# EAGLE schematic spot_check_rev_3 (EAGLE 9.6.2)
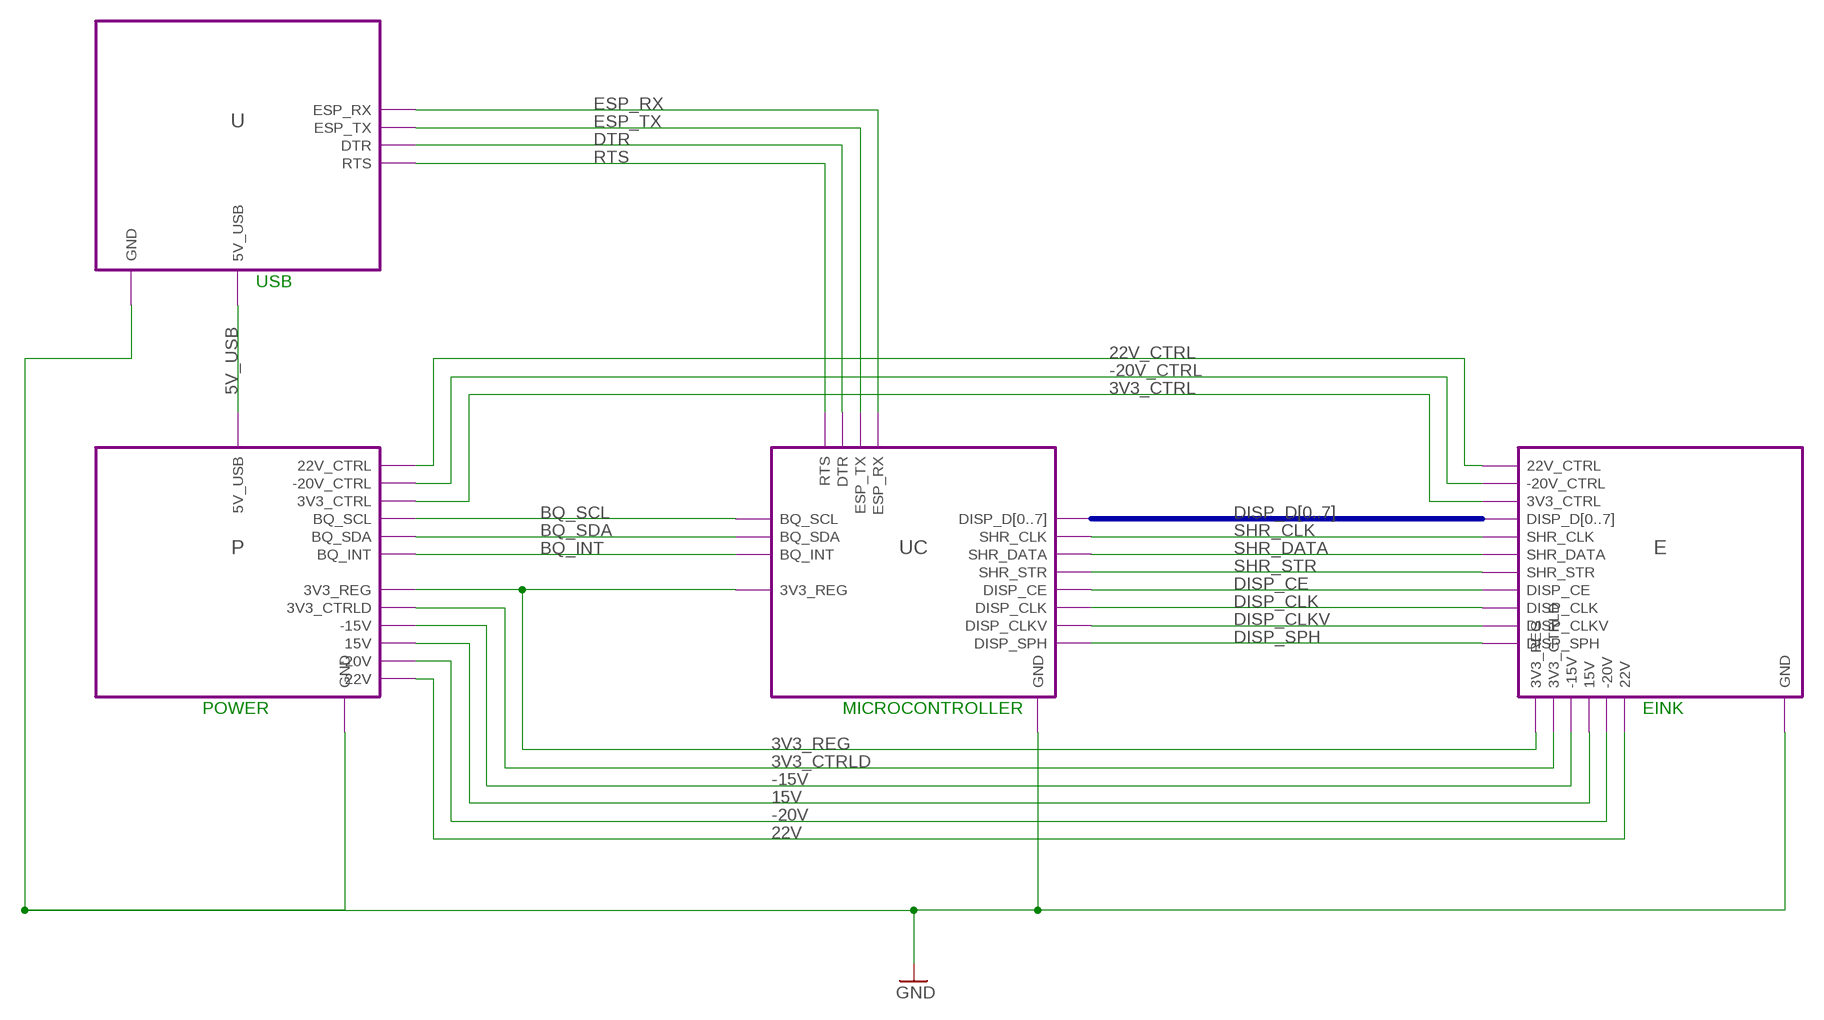
[diagram p0: schematic, sheet 1]

## Module instances
P = POWER
UC = MICROCONTROLLER
E = E-INK-DISPLAY
U = USB

## Nets
3V3_CTRL: port P.3V3_CTRL E.3V3_CTRL
3V3_CTRLD: port E.3V3_CTRLD P.3V3_CTRLD
3V3_REG: port UC.3V3_REG P.3V3_REG E.3V3_REG
5V_USB: port U.5V_USB P.5V_USB
15V: port E.15V P.15V
22V: port E.22V P.22V
22V_CTRL: port E.22V_CTRL P.22V_CTRL
-15V: port E.-15V P.-15V
-20V: port E.-20V P.-20V
-20V_CTRL: port P.-20V_CTRL E.-20V_CTRL
BQ_INT: port P.BQ_INT UC.BQ_INT
BQ_SCL: port UC.BQ_SCL P.BQ_SCL
BQ_SDA: port P.BQ_SDA UC.BQ_SDA
DISP_CE: port UC.DISP_CE E.DISP_CE
DISP_CLK: port E.DISP_CLK UC.DISP_CLK
DISP_CLKV: port UC.DISP_CLKV E.DISP_CLKV
DISP_SPH: port E.DISP_SPH UC.DISP_SPH
DTR: port UC.DTR U.DTR
ESP_RX: port U.ESP_RX UC.ESP_RX
ESP_TX: port U.ESP_TX UC.ESP_TX
GND: port P.GND E.GND UC.GND U.GND
RTS: port U.RTS UC.RTS
SHR_CLK: port UC.SHR_CLK E.SHR_CLK
SHR_DATA: port UC.SHR_DATA E.SHR_DATA
SHR_STR: port E.SHR_STR UC.SHR_STR

## Buses
DISP_D[0..7]

## Notes on the sheet
- USB
- POWER | MICROCONTROLLER | EINK

## Library data of the parts

## Module POWER
Ports: 22V(pwr) -20V(pwr) 15V(pwr) -15V(pwr) 3V3_CTRLD(pwr) 3V3_REG(pwr) 5V_USB(pwr) GND(pwr) BQ_SCL(in) BQ_SDA(in) BQ_INT(out) 22V_CTRL(in) -20V_CTRL(in) 3V3_CTRL(in)
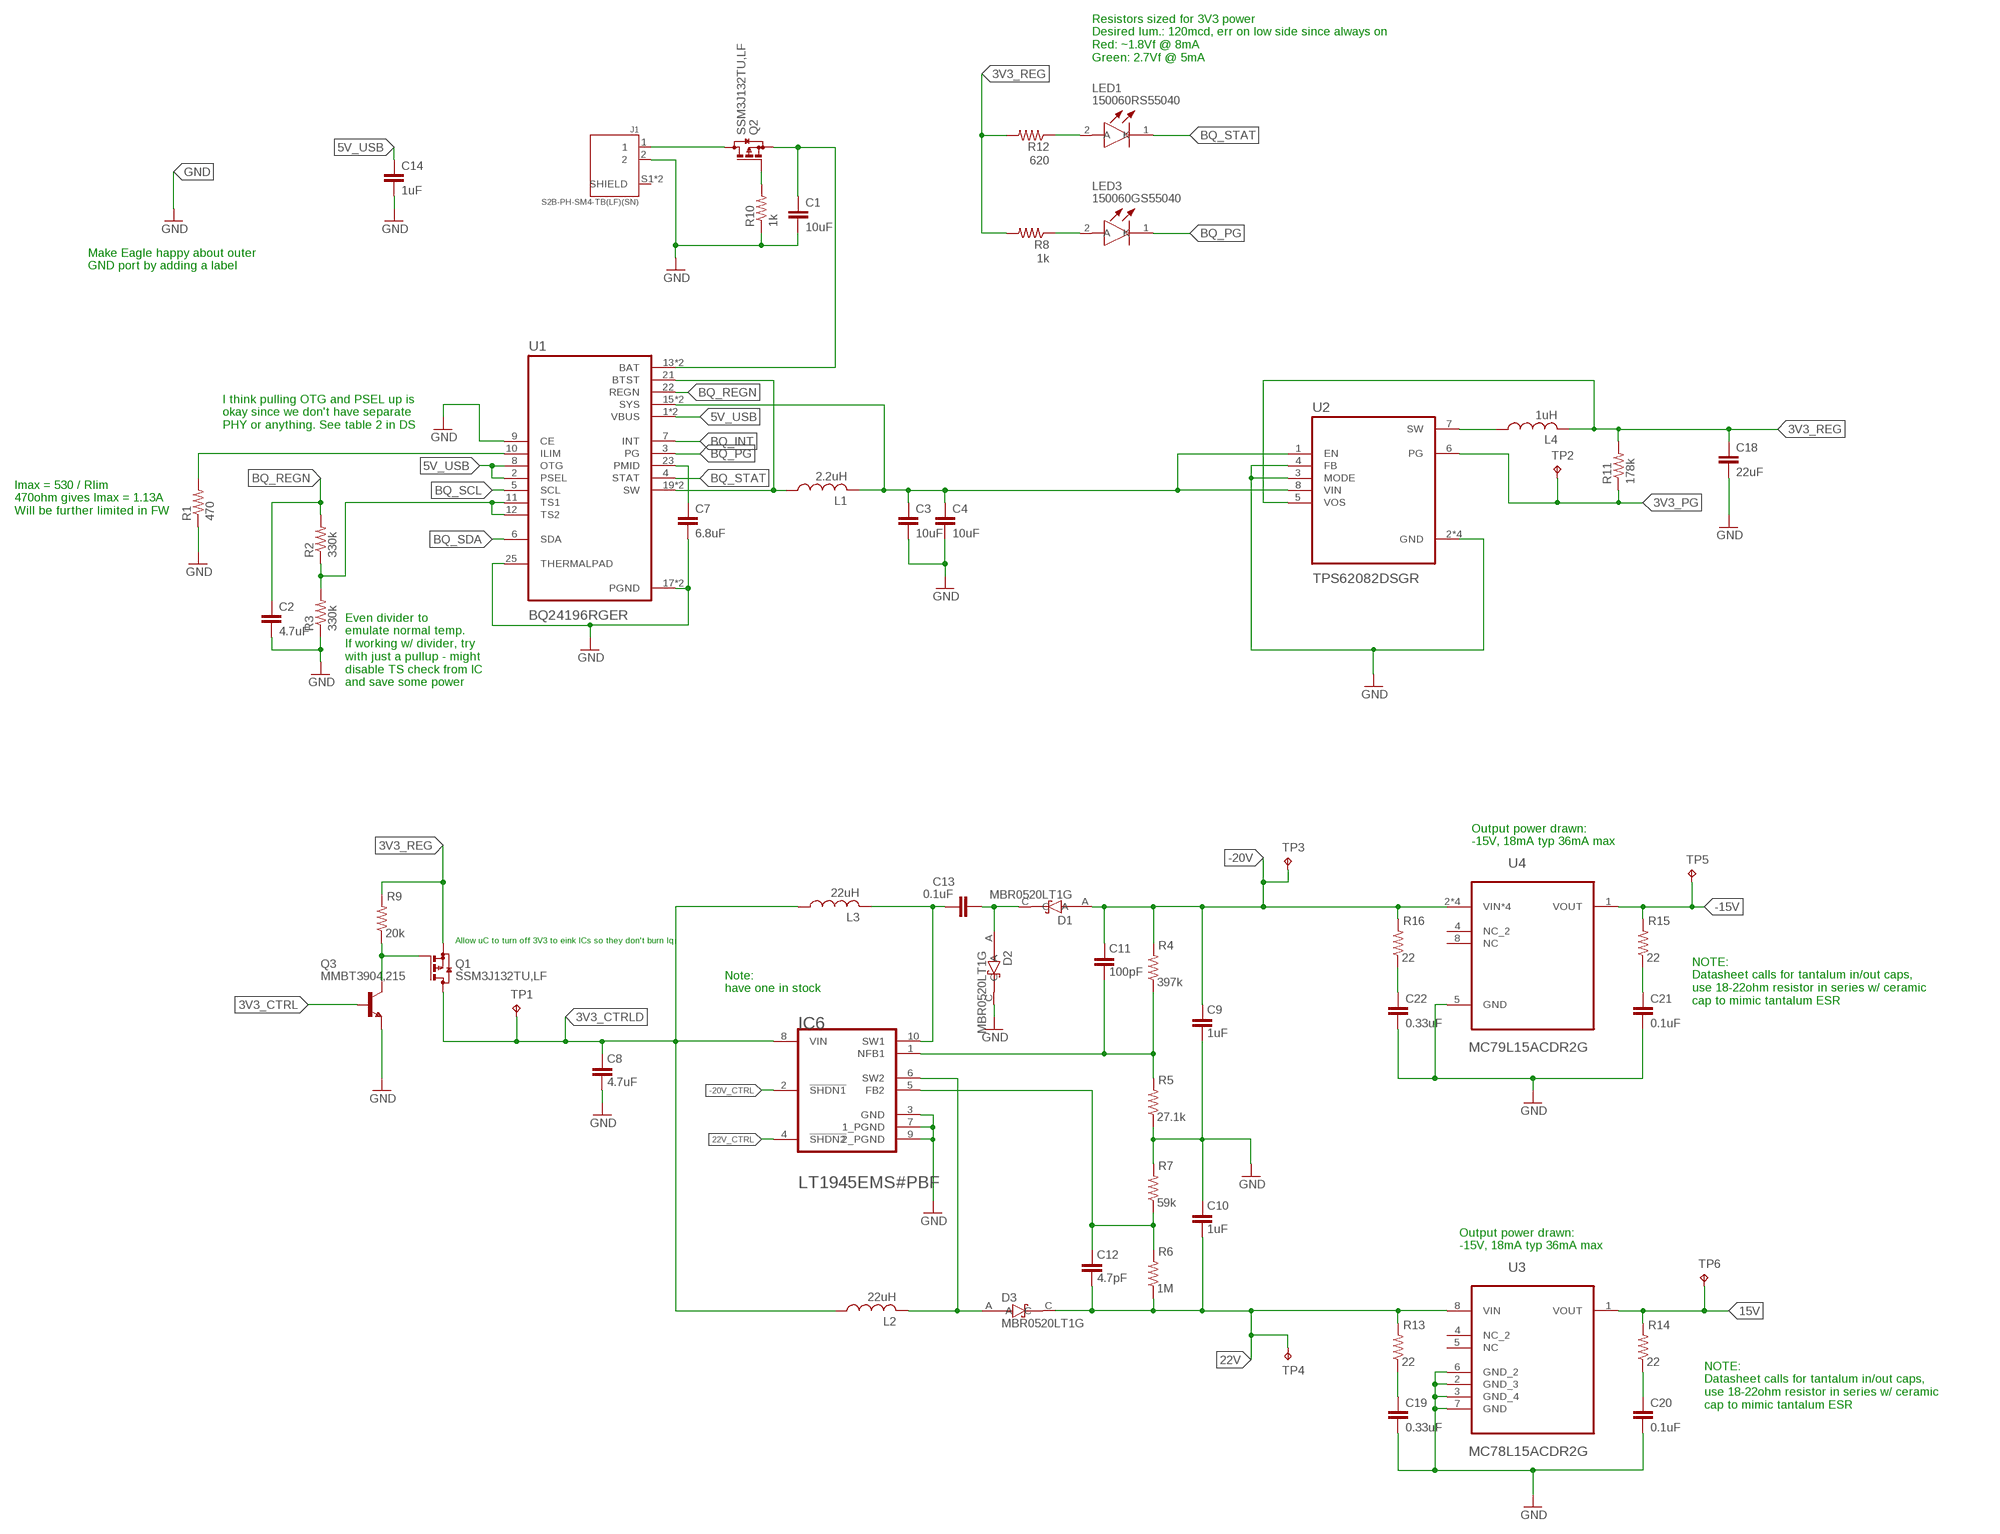
[diagram p1: schematic, module POWER, sheet 1]

### Parts
C1  10uF  C-EUC0805  [C0805]
C2  4.7uF  C-EUC0805  [C0805]
C3  10uF  C-EUC0805  [C0805]
C4  10uF  C-EUC0805  [C0805]
C7  6.8uF  C-EUC1210  [C1210]
C8  4.7uF  C-EUC0805  [C0805]
C9  1uF  C-EUC0805  [C0805]
C10  1uF  C-EUC0805  [C0805]
C11  100pF  C-EUC0805  [C0805]
C12  4.7pF  C-EUC0805  [C0805]
C13  0.1uF  C-EUC0805  [C0805]
C14  1uF  C-EUC0805  [C0805]
C18  22uF  C-EUC0805  [C0805]
C19  0.33uF  C-EUC0805  [C0805]
C20  0.1uF  C-EUC0805  [C0805]
C21  0.1uF  C-EUC0805  [C0805]
C22  0.33uF  C-EUC0805  [C0805]
D1  MBR0520LT1G  [SOD3716X135N]
D2  MBR0520LT1G  [SOD3716X135N]
D3  MBR0520LT1G  [SOD3716X135N]
IC6  LINEAR_TECHNOLOGY_LT1945EMS#PBFLINEAR_TECHNOLOGY_LT1945EMS#PBF_0_0  [LINEAR_TECHNOLOGY_LT1945EMS#PBF_0]
J1  S2B-PH-SM4-TB(LF)(SN)  [JST_S2B-PH-SM4-TB(LF)(SN)]
L1  2.2uH  L-USL1812  [L1812]
L2  22uH  L-US  [C1210]
L3  22uH  L-US  [C1210]
L4  1uH  L-USL1812  [L1812]
LED1  150060RS55040  150060VS75000  [LEDC1608X80N]
LED3  150060GS55040  150060VS75000  [LEDC1608X80N]
Q1  SSM3J132TU,LF  [SOT323]
Q2  SSM3J132TU,LF  [SOT323]
Q3  MMBT3904,215  BC848ALT1SMD  [SOT23]
R1  470  R-US_R0805  [R0805]
R2  330k  R-US_R0805  [R0805]
R3  330k  R-US_R0805  [R0805]
R4  397k  R-US_R0805  [R0805]
R5  27.1k  R-US_R0603  [R0603]
R6  1M  R-US_R0805  [R0805]
R7  59k  R-US_R0805  [R0805]
R8  1k  R-US_R0805  [R0805]
R9  20k  R-US_R0805  [R0805]
R10  1k  R-US_R0805  [R0805]
R11  178k  R-US_R0805  [R0805]
R12  620  R-US_R0805  [R0805]
R13  22  R-US_R0805  [R0805]
R14  22  R-US_R0805  [R0805]
R15  22  R-US_R0805  [R0805]
R16  22  R-US_R0805  [R0805]
TP1  TPB1,27  [B1,27]
TP2  TPB1,27  [B1,27]
TP3  TPB1,27  [B1,27]
TP4  TPB1,27  [B1,27]
TP5  TPB1,27  [B1,27]
TP6  TPB1,27  [B1,27]
U1  BQ24196RGER  [QFN50P400X400X100-25N]
U2  TPS62082DSGR  [SON50P200X200X80-9N]
U3  MC78L15ACDR2G  [SOIC127P600X175-8N]
U4  MC79L15ACDR2G  [SOIC127P600X175-8N]

### Nets
3V3_CTRL: Q3.1(B)
3V3_CTRLD: C8.1 IC6.8(VIN) L2.1 L3.1 Q1.3(D) TP1.TP
3V3_PG: R11.1 TP2.TP U2.6(PG)
3V3_REG: C18.1 L4.2 Q1.2(S) R8.2 R9.2 R11.2 R12.2 U2.5(VOS)
5V_USB: C14.1 U1.1(VBUS) U1.2(PSEL) U1.8(OTG) U1.24(VBUS)
15V: R14.2 TP6.TP U3.1(VOUT)
22V: C10.2 C12.2 D3.C R6.1 R13.2 TP4.TP U3.8(VIN)
22V_CTRL: IC6.4(!SHDN2!)
-15V: R15.2 TP5.TP U4.1(VOUT)
-20V: C9.1 C11.1 D1.A R4.2 R16.2 TP3.TP U4.2(VIN*4) U4.3(VIN*4) U4.6(VIN*4) U4.7(VIN*4)
-20V_CTRL: IC6.2(!SHDN1!)
BQ_INT: U1.7(INT)
BQ_PG: LED3.1(K) U1.3(PG)
BQ_REGN: C2.1 R2.2 U1.22(REGN)
BQ_SCL: U1.5(SCL)
BQ_SDA: U1.6(SDA)
BQ_STAT: LED1.1(K) U1.4(STAT)
GND: C1.2 C2.2 C3.2 C4.2 C7.2 C8.2 C9.2 C10.1 C14.2 C18.2 C19.2 C20.2 C21.2 C22.2 D2.C IC6.3(GND) IC6.7(1_PGND) IC6.9(2_PGND) J1.2 Q3.2(E) R1.1 R3.1 R5.1 R7.2 R10.1 U1.9(CE) U1.17(PGND) U1.18(PGND) U1.25(THERMALPAD) U2.2(GND) U2.3(MODE) U2.4(FB) U2.9(GND) U2.9_1(GND) U2.9_2(GND) U3.2(GND_3) U3.3(GND_4) U3.6(GND_2) U3.7(GND) U4.5(GND)
N$1: C1.1 Q2.2(S) U1.13(BAT) U1.14(BAT)
N$2: R2.1 R3.2 U1.11(TS1) U1.12(TS2)
N$3: L1.1 U1.19(SW) U1.20(SW) U1.21(BTST)
N$4: J1.1 Q2.3(D)
N$5: C7.1 U1.23(PMID)
N$6: R1.2 U1.10(ILIM)
N$7: LED3.2(A) R8.1
N$8: C3.1 C4.1 L1.2 U1.15(SYS) U1.16(SYS) U2.1(EN) U2.8(VIN)
N$9: Q2.1(G) R10.2
N$10: C12.1 IC6.5(FB2) R6.2 R7.1
N$11: L4.1 U2.7(SW)
N$12: LED1.2(A) R12.1
N$13: D3.A IC6.6(SW2) L2.2
N$14: C13.2 D1.C D2.A
N$15: Q1.1(G) Q3.3(C) R9.1
N$16: C13.1 IC6.10(SW1) L3.2
N$17: C11.2 IC6.1(NFB1) R4.1 R5.2
N$19: C22.1 R16.1
N$20: C21.1 R15.1
N$21: C20.1 R14.1
N$22: C19.1 R13.1
Unconnected: J1.S1(SHIELD) J1.S2(SHIELD) U3.4(NC_2) U3.5(NC) U4.4(NC_2) U4.8(NC)

### Notes on the sheet
- Resistors sized for 3V3 power
  Desired lum.: 120mcd, err on low side since always on
  Red: ~1.8Vf @ 8mA
  Green: 2.7Vf @ 5mA
- Make Eagle happy about outer
  GND port by adding a label
- I think pulling OTG and PSEL up is
  okay since we don't have separate 
  PHY or anything. See table 2 in DS
- Imax = 530 / Rlim
  470ohm gives Imax = 1.13A
  Will be further limited in FW
- Even divider to 
  emulate normal temp.
  If working w/ divider, try
  with just a pullup - might
  disable TS check from IC
  and save some power
- Output power drawn:
  -15V, 18mA typ 36mA max
- Allow uC to turn off 3V3 to eink ICs so they don't burn Iq
- Note:
  have one in stock
- NOTE:
  Datasheet calls for tantalum in/out caps,
  use 18-22ohm resistor in series w/ ceramic
  cap to mimic tantalum ESR
- Output power drawn:
  -15V, 18mA typ 36mA max
- NOTE:
  Datasheet calls for tantalum in/out caps,
  use 18-22ohm resistor in series w/ ceramic
  cap to mimic tantalum ESR

### Library data of the parts
C1-C4 C7-C14 C18-C22 = rcl:C-EU: CAPACITOR, European symbol; SPICEPREFIX: C
D1-D3 = MBR0520LT1G:MBR0520LT1G: Rectifier, Schottky Power; Plastic Sod-123; 0.5 a @ +90c If; +125; 20v; 1000 Check prices <https://pricing.snapeda.com/parts/MBR0520LT1G/ON%20Semiconductor/view-part?ref=eda>; AVAILABILITY: In Stock; DESCRIPTION: Diode Schottky 20V 500mA Surface Mount SOD-123; MF: ON Semiconductor; MP: MBR0520LT1G; PACKAGE: SOD-123-2 ON Semiconductor; PRICE: None; PURCHASE-URL: https://pricing.snapeda.com/search/part/MBR0520LT1G/?ref=eda
IC6 = LT1945EMS#PBF:LINEAR_TECHNOLOGY_LT1945EMS#PBF: LT-LT1945-MS-10; CIIVA_IDS: 1482624; COMPONENT_LINK_1_DESCRIPTION: Manufacturer URL; COMPONENT_LINK_1_URL: http://www.linear.com/; COMPONENT_LINK_3_DESCRIPTION: Package Specification; COMPONENT_LINK_3_URL: http://cds.linear.com/docs/en/packaging/05081661_F_MS.pdf; DATASHEET: http://cds.linear.com/docs/en/datasheet/1945fa.pdf; DATASHEET_VERSION: Rev. A; FOOTPRINT_VARIANT_NAME_0: Level C; FOOTPRINT_VARIANT_NAME_1: Level B; FOOTPRINT_VARIANT_NAME_2: Level A; IMPORTED: yes; IMPORTED_FROM: vault; IMPORT_TS: 1521842479; MF: Linear Technology; MOUNTING_TECHNOLOGY: Surface Mount; MPN: LT1945EMS#PBF; NUMBER_OF_OUTPUTS: 2; PACKAGE: MS-10; PACKAGE_DESCRIPTION: 10-Pin Plastic MSOP, Body 3 x 3 mm, Pitch 0.5 mm; PACKAGE_VERSION: Rev. E, 06/2010; PREFIX: U; RELEASE_DATE: 1377814922; ROHS: Yes; VAULT_GUID: B0F6C986-74D1-4265-A3D3-2E2E10FD489A; VAULT_REVISION: 624277BD-F6E2-44C2-9180-A8188AE27574; VIN_MAXV: 15; VIN_MINV: 1.2
J1 = JST-S2B-PH-SM4-TB_LF__SN_:S2B-PH-SM4-TB(LF)(SN): PH Series 2 Position 2 mm Pitch Surface Mount Side Entry Shrouded Header Check availability <https://pricing.snapeda.com/parts/S2B-PH-SM4-TB%28LF%29%28SN%29/JST%20Sales/view-part?ref=eda>; AVAILABILITY: In Stock; DESCRIPTION: Connector Header Surface Mount, Right Angle 2 position 0.079 (2.00mm); MF: JST Sales; MP: S2B-PH-SM4-TB(LF)(SN); PACKAGE: None; PRICE: None
L1 L4 = rcl:L-US: INDUCTOR, American symbol; SPICEPREFIX: L
L2 L3 = custom_rcl:L-US: INDUCTOR, American symbol
LED1 LED3 = 150060VS75000:150060VS75000: LED,Wurth Elektronik,150060VS75000 Wurth Elektronik 150060VS75000, WL-SMCW Series Green LED, 570 nm, 1608 (0603) Clear, Rectangle Lens SMD Package Source: Datasheet <http://docs-emea.rs-online.com/webdocs/1302/0900766b81302e1e.pdf> Check prices <https://pricing.snapeda.com/parts/150060VS75000/Wurth%20Elektronik/view-part?ref=eda>; AVAILABILITY: In Stock; DESCRIPTION: Green 570nm LED Indication - Discrete 2V 0603 (1608 Metric); MF: Wurth Elektronik; MP: 150060VS75000; PACKAGE: None; PRICE: None
Q1 Q2 = SSM3J132TU:SSM3J132TU,LF
Q3 = transistor-npn:BC848*: NPN Transistor
R1-R16 = rcl:R-US_: RESISTOR, American symbol; SPICEPREFIX: R
TP1-TP6 = testpad:TP: Test pad
U1 = BQ24196RGER:BQ24196RGER: Check prices <https://pricing.snapeda.com/parts/BQ24196RGER/Texas%20Instruments/view-part?ref=eda>; AVAILABILITY: In Stock; DESCRIPTION: I2C controlled 2.5A single cell USB/Adaptor charger w/ Narrow VDC Power Path 24-VQFN -40 to 85; MF: Texas Instruments; MP: BQ24196RGER; PACKAGE: VQFN-24 Texas Instruments; PRICE: None; PURCHASE-URL: https://pricing.snapeda.com/search/part/BQ24196RGER/?ref=eda
U2 = TPS62082DSGR:TPS62082DSGR: Check availability <https://pricing.snapeda.com/parts/TPS62082DSGR/Texas%20Instruments/view-part?ref=eda>; AVAILABILITY: In Stock; DESCRIPTION: 1.2A High Efficient Step Down Converter in 2x2mm SON Package. 3.3 Vout (Min) 8-WSON -40 to 125; MF: Texas Instruments; MP: TPS62082DSGR; PACKAGE: WSON-8 Texas Instruments; PRICE: None; PURCHASE-URL: https://pricing.snapeda.com/search/part/TPS62082DSGR/?ref=eda
U3 = MC78L15ACDR2G:MC78L15ACDR2G: Positive Linear Voltage Regulator Check availability <https://pricing.snapeda.com/parts/MC78L15ACDR2G/ON%20Semiconductor/view-part?ref=eda>; AVAILABILITY: In Stock; DESCRIPTION: Linear Voltage Regulator IC Positive Fixed 1 Output 100mA 8-SOIC; MF: ON Semiconductor; MP: MC78L15ACDR2G; PACKAGE: SOIC-8 ON Semiconductor; PRICE: None; PURCHASE-URL: https://pricing.snapeda.com/search/part/MC78L15ACDR2G/?ref=eda
U4 = MC78L15ACDR2G:MC79L15ACDR2G

## Module MICROCONTROLLER
Ports: DISP_D[0..7](out) 3V3_REG(pwr) SHR_CLK(out) SHR_DATA(out) SHR_STR(out) DISP_CE(out) DISP_CLK(out) DISP_CLKV(out) DISP_SPH(out) RTS(in) DTR(in) ESP_TX(out) ESP_RX(in) GND(pwr) BQ_SCL(out) BQ_SDA(out) BQ_INT(in)
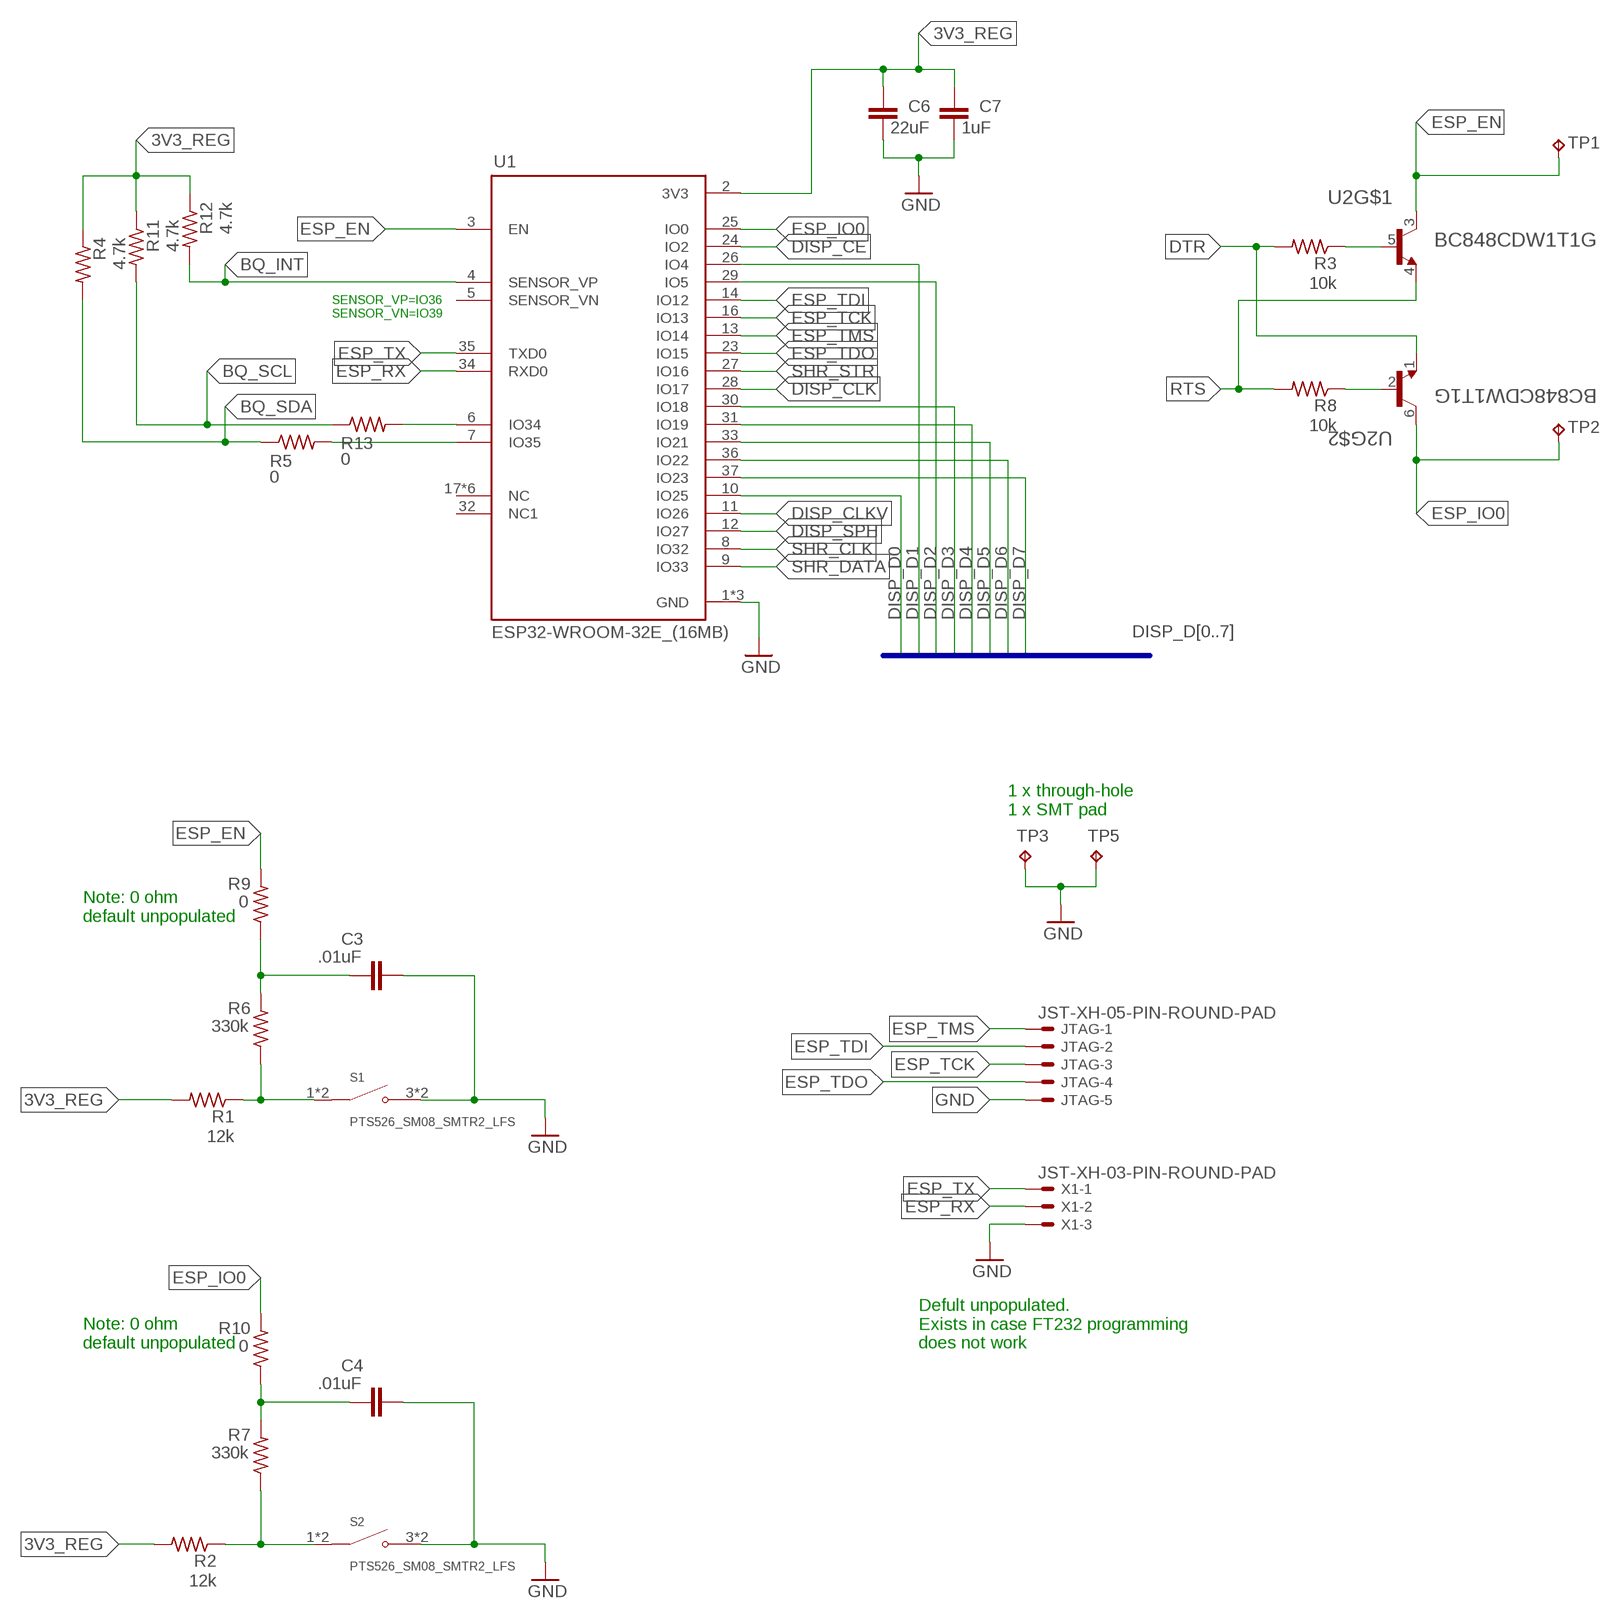
[diagram p2: schematic, module MICROCONTROLLER, sheet 1]

### Parts
C3  .01uF  C-EUC0805  [C0805]
C4  .01uF  C-EUC0805  [C0805]
C6  22uF  C-EUC0805  [C0805]
C7  1uF  C-EUC0805  [C0805]
JTAG  JST-XH-05-PIN-ROUND-PAD  [JST-XH-05-PACKAGE-ROUND-PAD]
R1  12k  R-US_R0805  [R0805]
R2  12k  R-US_R0805  [R0805]
R3  10k  R-US_R0805  [R0805]
R4  4.7k  R-US_R0805  [R0805]
R5  0  R-US_R0805  [R0805]
R6  330k  R-US_R0805  [R0805]
R7  330k  R-US_R0805  [R0805]
R8  10k  R-US_R0805  [R0805]
R9  0  R-US_R0805  [R0805]
R10  0  R-US_R0805  [R0805]
R11  4.7k  R-US_R0805  [R0805]
R12  4.7k  R-US_R0805  [R0805]
R13  0  R-US_R0805  [R0805]
S1  PTS526_SM08_SMTR2_LFS  [SW_PTS526_SM08_SMTR2_LFS]
S2  PTS526_SM08_SMTR2_LFS  [SW_PTS526_SM08_SMTR2_LFS]
TP1  TPB1,27  [B1,27]
TP2  TPB1,27  [B1,27]
TP3  TPPAD1-20  [P1-20]
TP5  TPB1,27  [B1,27]
U1  ESP32-WROOM-32E_(16MB)  [MODULE_ESP32-WROOM-32E_(16MB)]
U2  BC848CDW1T1G  [SOT65P210X110-6N]
X1  JST-XH-03-PIN-ROUND-PAD  [JST-XH-03-PACKAGE-ROUND-PAD]

### Nets
3V3_REG: C6.1 C7.1 R1.2 R2.2 R4.1 R11.1 R12.1 U1.2(3V3)
BQ_INT: R12.2 U1.4(SENSOR_VP)
BQ_SCL: R11.2 R13.1
BQ_SDA: R4.2 R5.1
DISP_CE: U1.24(IO2)
DISP_CLK: U1.28(IO17)
DISP_CLKV: U1.11(IO26)
DISP_D0: U1.10(IO25)
DISP_D1: U1.26(IO4)
DISP_D2: U1.29(IO5)
DISP_D3: U1.30(IO18)
DISP_D4: U1.31(IO19)
DISP_D5: U1.33(IO21)
DISP_D6: U1.36(IO22)
DISP_D7: U1.37(IO23)
DISP_SPH: U1.12(IO27)
DTR: R3.2 U2.1(EMITTER_2)
ESP_EN: R9.2 TP1.TP U1.3(EN) U2.3(COLLECTOR_1)
ESP_IO0: R10.2 TP2.TP U1.25(IO0) U2.6(COLLECTOR_2)
ESP_RX: U1.34(RXD0) X1.2
ESP_TCK: JTAG.3 U1.16(IO13)
ESP_TDI: JTAG.2 U1.14(IO12)
ESP_TDO: JTAG.4 U1.23(IO15)
ESP_TMS: JTAG.1 U1.13(IO14)
ESP_TX: U1.35(TXD0) X1.1
GND: C3.2 C4.2 C6.2 C7.2 JTAG.5 S1.3(NO) S1.4(NO) S2.3(NO) S2.4(NO) TP3.TP TP5.TP U1.1(GND) U1.15(GND) U1.38(GND) X1.3
N$1: R3.1 U2.5(BASE_1)
N$2: R13.2 U1.6(IO34)
N$3: R5.2 U1.7(IO35)
N$4: R8.1 U2.2(BASE_2)
N$5: R1.1 R6.1 S1.1(COM) S1.2(COM)
N$6: R2.1 R7.1 S2.1(COM) S2.2(COM)
N$7: C4.1 R7.2 R10.1
N$9: C3.1 R6.2 R9.1
RTS: R8.2 U2.4(EMITTER_1)
SHR_CLK: U1.8(IO32)
SHR_DATA: U1.9(IO33)
SHR_STR: U1.27(IO16)
Unconnected: U1.5(SENSOR_VN) U1.17(NC) U1.18(NC) U1.19(NC) U1.20(NC) U1.21(NC) U1.22(NC) U1.32(NC1)

### Buses
DISP_D[0..7]

### Notes on the sheet
- SENSOR_VP=IO36
  SENSOR_VN=IO39
- 1 x through-hole
  1 x SMT pad
- Note: 0 ohm
  default unpopulated
- Note: 0 ohm
  default unpopulated
- Defult unpopulated.
  Exists in case FT232 programming
  does not work

### Library data of the parts
C3 C4 C6 C7 = rcl:C-EU: CAPACITOR, European symbol; SPICEPREFIX: C
JTAG = Rembrandt Electronics - JST XH Connectors v1-0:JST-XH-05-PIN: JST XH Connector 2 Pin Wire to board connector. Pitch: 2,54 mm, (0.100") Number of pins: 5 Created by Rembrandt Electronics www.rembrandtelectronics.com
R1-R13 = rcl:R-US_: RESISTOR, American symbol; SPICEPREFIX: R
S1 S2 = PTS526_SM08_SMTR2_LFS:PTS526_SM08_SMTR2_LFS: Tactile Switch SPST-NO Top Actuated Surface Mount Check availability <https://pricing.snapeda.com/parts/PTS526%20SM08%20SMTR2%20LFS/C%26K/view-part?ref=eda>; AVAILABILITY: In Stock; DESCRIPTION: Tactile Switch SPST-NO Top Actuated Surface Mount; MF: C&K; MP: PTS526 SM08 SMTR2 LFS; PACKAGE: None; PRICE: None; PURCHASE-URL: https://pricing.snapeda.com/search/part/PTS526 SM08 SMTR2 LFS/?ref=eda
TP1-TP3 TP5 = testpad:TP: Test pad
U1 = ESP32-WROOM-32E__16MB_:ESP32-WROOM-32E_(16MB): Bluetooth, WiFi 802.11b/g/n, Bluetooth v4.2 +EDR, Class 1, 2 and 3 Transceiver Module 2.4GHz ~ 2.5GHz Integrated, Trace Surface Mount Check prices <https://pricing.snapeda.com/parts/ESP32-WROOM-32E%20%2816MB%29/Espressif%20Systems/view-part?ref=eda>; AVAILABILITY: Not in stock; DESCRIPTION: Bluetooth, WiFi 802.11b/g/n, Bluetooth v4.2 +EDR, Class 1, 2 and 3 Transceiver Module 2.4GHz ~ 2.5GHz Integrated, Trace Surface Mount; MF: Espressif Systems; MP: ESP32-WROOM-32E (16MB); PACKAGE: Module Espressif Systems; PRICE: None
U2 = BC848CDW1T1G:BC848CDW1T1G: Bipolar (BJT) Transistor Array 2 NPN (Dual) 45V 100mA 100MHz 380mW Surface Mount SC-88/SC70-6/SOT-363 Check availability <https://pricing.snapeda.com/parts/BC848CDW1T1G/ON%20Semiconductor/view-part?ref=eda>; AVAILABILITY: In Stock; DESCRIPTION: Bipolar (BJT) Transistor Array 2 NPN (Dual) 30V 100mA 100MHz 380mW Surface Mount SC-88/SC70-6/SOT-363; MF: ON Semiconductor; MP: BC848CDW1T1G; PACKAGE: SC-88-6 ON Semiconductor; PRICE: None; PURCHASE-URL: https://pricing.snapeda.com/search/part/BC848CDW1T1G/?ref=eda
X1 = Rembrandt Electronics - JST XH Connectors v1-0:JST-XH-03-PIN: JST XH Connector 2 Pin Wire to board connector. Pitch: 2,54 mm, (0.100") Number of pins: 3 Created by Rembrandt Electronics www.rembrandtelectronics.com

## Module E-INK-DISPLAY
Ports: DISP_D[0..7](in) 22V(pwr) -20V(pwr) 15V(pwr) -15V(pwr) SHR_CLK(in) SHR_DATA(in) SHR_STR(in) DISP_CE(in) DISP_CLK(in) DISP_CLKV(in) DISP_SPH(in) 3V3_CTRLD(pwr) GND(pwr) 22V_CTRL(out) -20V_CTRL(out) 3V3_CTRL(out) 3V3_REG(pwr)
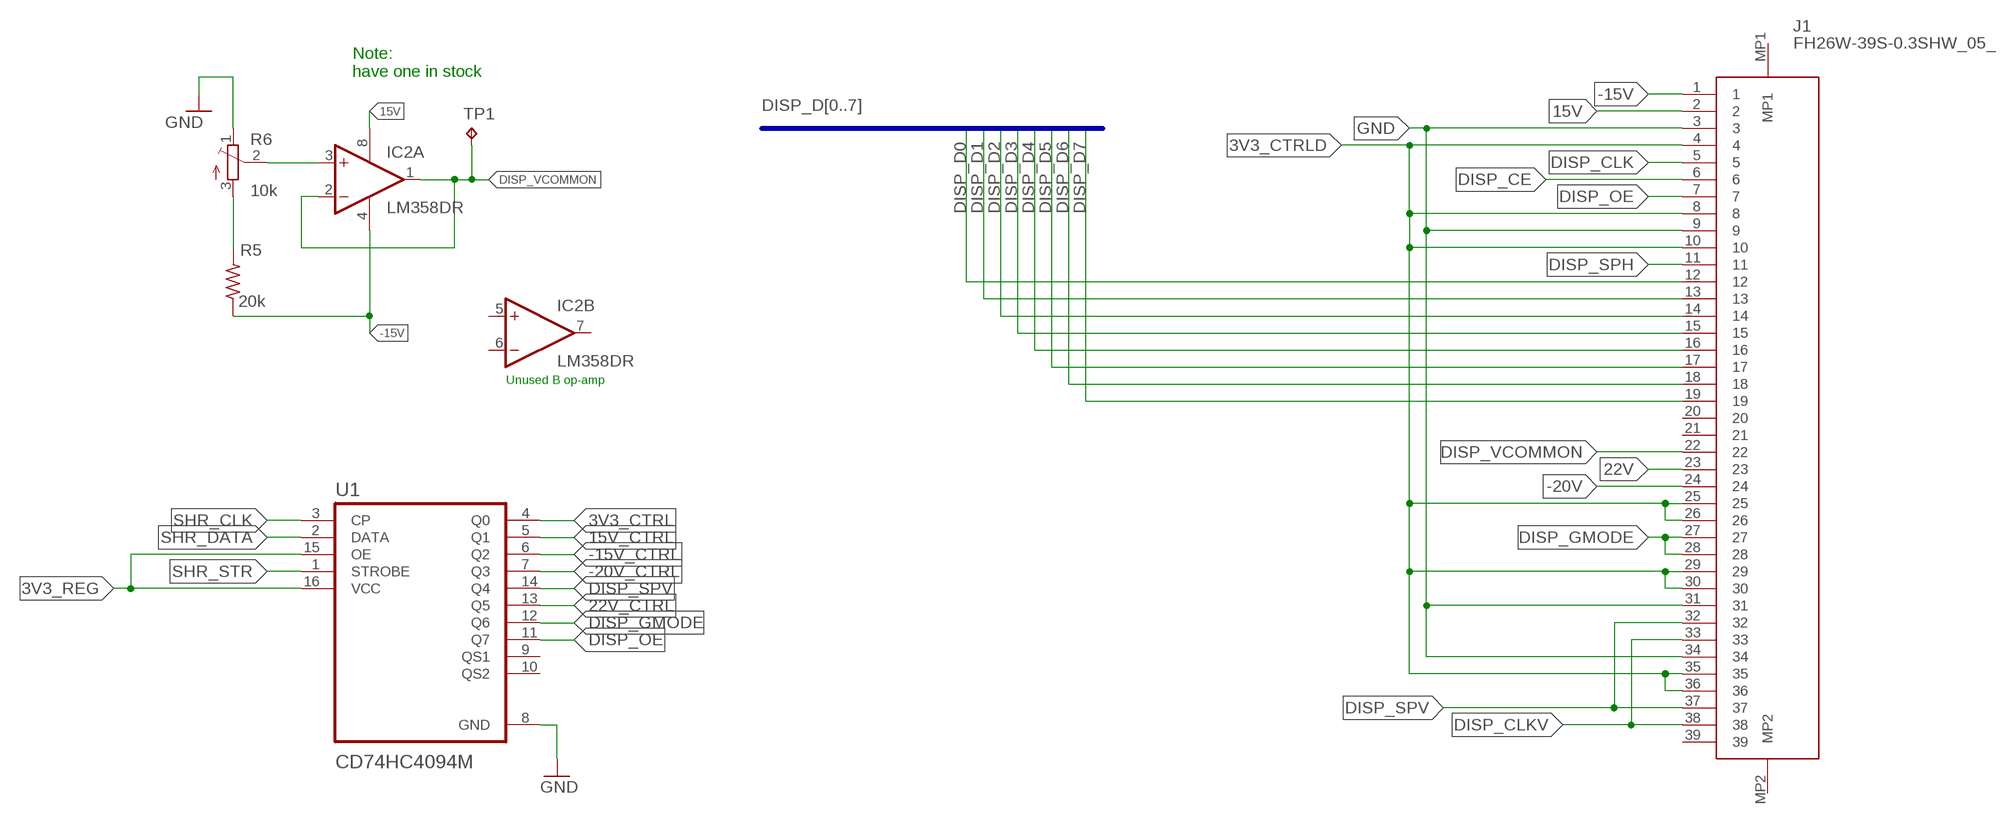
[diagram p3: schematic, module E-INK-DISPLAY, sheet 1]

### Parts
IC2  LM358DR  LM358D  [SO08]
J1  FH26W-39S-0.3SHW_05_  [FH26W39S03SHW05]
R5  20k  R-US_R0805  [R0805]
R6  10k  TC33X-1-103E  [TRIM_TC33X-2-333E]
TP1  TPB1,27  [B1,27]
U1  CD74HC4094M  [SOIC127P600X175-16N]

### Nets
3V3_CTRL: U1.4(Q0)
3V3_CTRLD: J1.4 J1.8 J1.10 J1.25 J1.26 J1.29 J1.30 J1.35 J1.36
3V3_REG: U1.15(OE) U1.16(VCC)
15V: IC2.8(P:V+) J1.2
15V_CTRL: U1.5(Q1)
22V: J1.23
22V_CTRL: U1.13(Q5)
-15V: IC2.4(P:V-) J1.1 R5.1
-15V_CTRL: U1.6(Q2)
-20V: J1.24
-20V_CTRL: U1.7(Q3)
DISP_CE: J1.6
DISP_CLK: J1.5
DISP_CLKV: J1.33 J1.38
DISP_D0: J1.12
DISP_D1: J1.13
DISP_D2: J1.14
DISP_D3: J1.15
DISP_D4: J1.16
DISP_D5: J1.17
DISP_D6: J1.18
DISP_D7: J1.19
DISP_GMODE: J1.27 J1.28 U1.12(Q6)
DISP_OE: J1.7 U1.11(Q7)
DISP_SPH: J1.11
DISP_SPV: J1.32 J1.37 U1.14(Q4)
DISP_VCOMMON: IC2.1(A:OUT) IC2.2(A:-IN) J1.22 TP1.TP
GND: J1.3 J1.9 J1.31 J1.34 R6.1(E) U1.8(GND)
N$2: R5.2 R6.3(A)
N$3: IC2.3(A:+IN) R6.2(S)
SHR_CLK: U1.3(CP)
SHR_DATA: U1.2(DATA)
SHR_STR: U1.1(STROBE)
Unconnected: IC2.5(B:+IN) IC2.6(B:-IN) IC2.7(B:OUT) J1.20 J1.21 J1.39 J1.MP1 J1.MP2 U1.9(QS1) U1.10(QS2)

### Buses
DISP_D[0..7]

### Notes on the sheet
- Note:
  have one in stock
- Unused B op-amp

### Library data of the parts
IC2 = linear:LM358: OP AMP also LM158; LM258; LM2904 Source: http://cache.national.com/ds/LM/LM158.pdf
J1 = FH26W-39S-0.3SHW_05_:FH26W-39S-0.3SHW_05_: FFC & FPC Connectors 39P SMT HORIZ ZIF 1MM HGHT .3MM PITCH Source: Datasheet <http://www.mouser.cn/datasheet/2/185/FH26_catalog-939414.pdf>; DESCRIPTION: FFC & FPC Connectors 39P SMT HORIZ ZIF 1MM HGHT .3MM PITCH; HEIGHT: 1mm; MANUFACTURER_NAME: Hirose; MANUFACTURER_PART_NUMBER: FH26W-39S-0.3SHW(05); MOUSER_PART_NUMBER: 798-FH26W39S03SHW05; MOUSER_PRICE-STOCK: https://www.mouser.co.uk/ProductDetail/Hirose-Connector/FH26W-39S-03SHW05?qs=vnk2wBG9e14RpudjtVAEhA%3D%3D
R5 = rcl:R-US_: RESISTOR, American symbol; SPICEPREFIX: R
R6 = TRIM_TC33X-2-333E:TC33X-1-103E
TP1 = testpad:TP: Test pad
U1 = CD74HC4094M:CD74HC4094M: Check availability <https://pricing.snapeda.com/parts/CD74HC4094M/Texas%20Instruments/view-part?ref=eda>; AVAILABILITY: In Stock; DESCRIPTION: High Speed CMOS Logic 8-Stage Shift-and-Store Bus Register with 3-Stage Outputs 16-SOIC -55 to 125; MF: Texas Instruments; MP: CD74HC4094M; PACKAGE: SOIC-16 Texas Instruments; PRICE: None; PURCHASE-URL: https://pricing.snapeda.com/search/part/CD74HC4094M/?ref=eda

## Module USB
Ports: 5V_USB(pwr) ESP_RX(out) ESP_TX(in) DTR(out) RTS(out) GND(pwr)
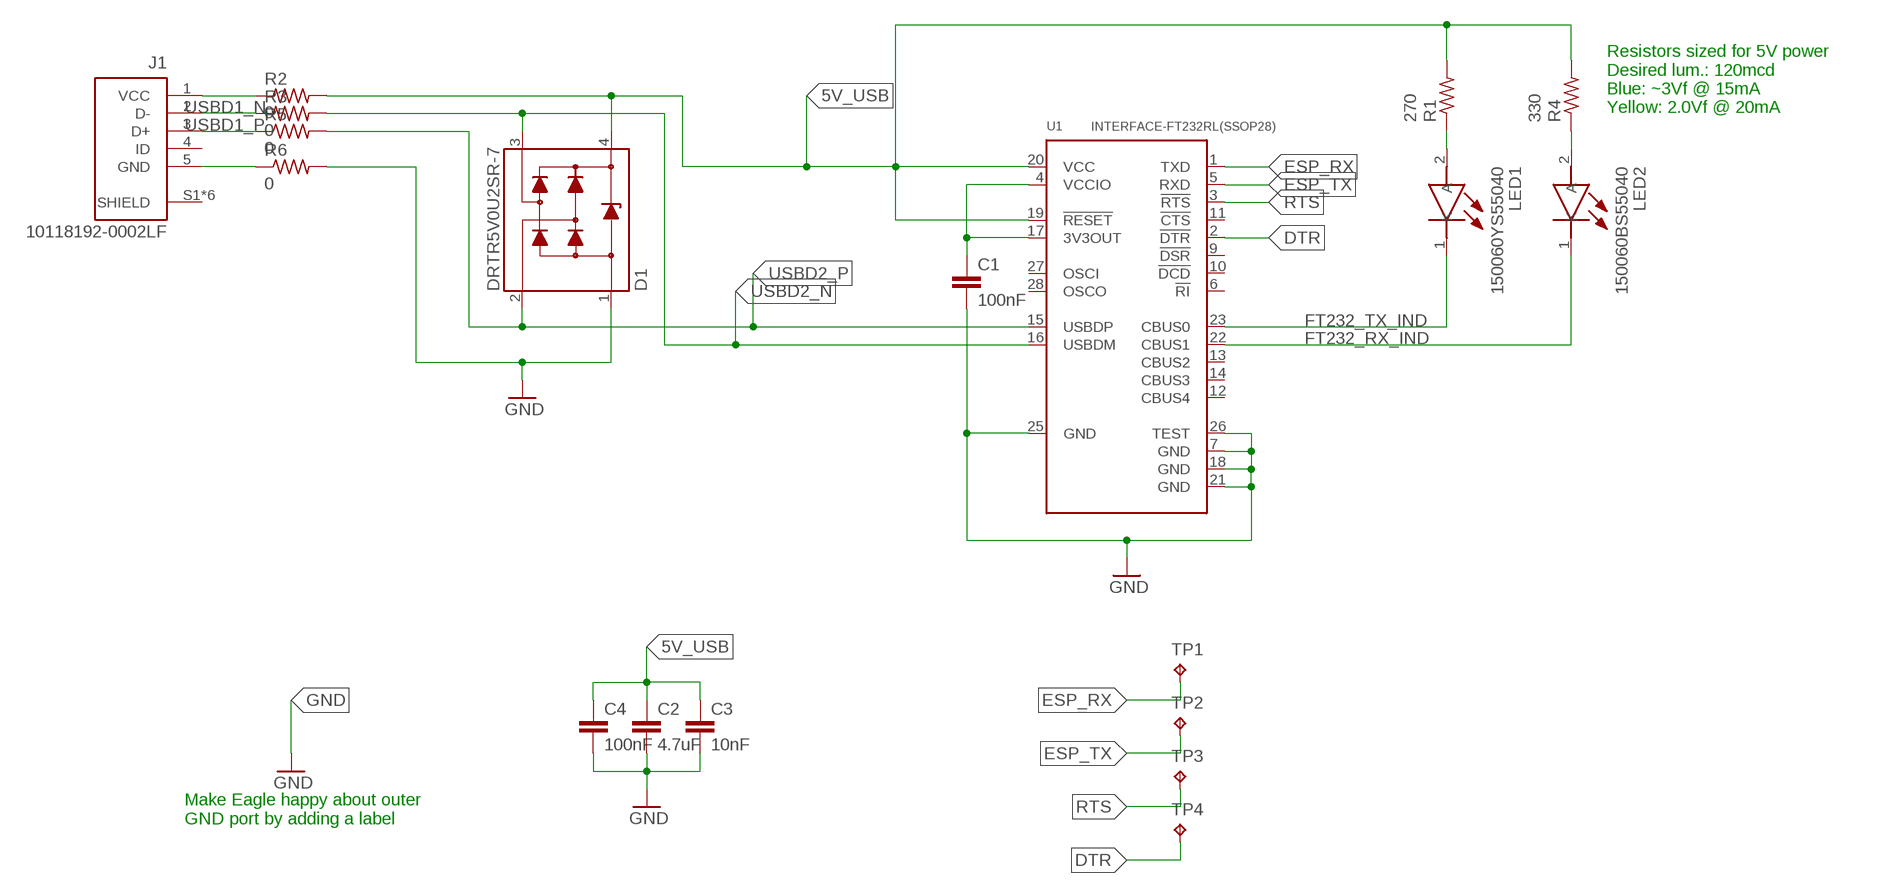
[diagram p4: schematic, module USB, sheet 1]

### Parts
C1  100nF  C-EUC0805  [C0805]
C2  4.7uF  C-EUC0805  [C0805]
C3  10nF  C-EUC0805  [C0805]
C4  100nF  C-EUC0805  [C0805]
D1  DRTR5V0U2SR-7  [SOT143]
J1  10118192-0002LF  [AMPHENOL_10118192-0002LF]
LED1  150060YS55040  150060VS75000  [LEDC1608X80N]
LED2  150060BS55040  150060VS75000  [LEDC1608X80N]
R1  270  R-US_R0805  [R0805]
R2  0  R-US_R0805  [R0805]
R3  0  R-US_R0805  [R0805]
R4  330  R-US_R0805  [R0805]
R5  0  R-US_R0805  [R0805]
R6  0  R-US_R0805  [R0805]
TP1  TPB1,27  [B1,27]
TP2  TPB1,27  [B1,27]
TP3  TPB1,27  [B1,27]
TP4  TPB1,27  [B1,27]
U1  INTERFACE-FT232RL(SSOP28)  [SSOP28-0.65-10.2X5.2MM]

### Nets
5V_USB: C2.1 C3.1 C4.1 D1.4(VCC) R1.2 R2.2 R4.2 U1.19(!RESET) U1.20(VCC)
DTR: TP4.TP U1.2(!DTR)
ESP_RX: TP1.TP U1.1(TXD)
ESP_TX: TP2.TP U1.5(RXD)
FT232_RX_IND: LED2.1(K) U1.22(CBUS1)
FT232_TX_IND: LED1.1(K) U1.23(CBUS0)
GND: C1.2 C2.2 C3.2 C4.2 D1.1(GND) R6.2 U1.7(GND) U1.18(GND) U1.21(GND) U1.25(GND) U1.26(TEST)
N$1: LED1.2(A) R1.1
N$2: LED2.2(A) R4.1
N$3: J1.1(VCC) R2.1
N$4: C1.1 U1.4(VCCIO) U1.17(3V3OUT)
N$7: J1.5(GND) R6.1
RTS: TP3.TP U1.3(!RTS)
USBD1_N: J1.2(D-) R3.1
USBD1_P: J1.3(D+) R5.1
USBD2_N: D1.3(I/O_2) R3.2 U1.16(USBDM)
USBD2_P: D1.2(I/O_1) R5.2 U1.15(USBDP)
Unconnected: J1.4(ID) J1.S1(SHIELD) J1.S2(SHIELD) J1.S3(SHIELD) J1.S4(SHIELD) J1.S5(SHIELD) J1.S6(SHIELD) U1.6(!RI) U1.9(!DSR) U1.10(!DCD) U1.11(!CTS) U1.12(CBUS4) U1.13(CBUS2) U1.14(CBUS3) U1.27(OSCI) U1.28(OSCO)

### Notes on the sheet
- Resistors sized for 5V power
  Desired lum.: 120mcd
  Blue: ~3Vf @ 15mA
  Yellow: 2.0Vf @ 20mA
- Make Eagle happy about outer
  GND port by adding a label

### Library data of the parts
C1-C4 = rcl:C-EU: CAPACITOR, European symbol; SPICEPREFIX: C
D1 = DRTR5V0U2SR-7:DRTR5V0U2SR-7: DIODE, TVS, DUAL, SOT-143B; Diode Type: TVS, Bidirectional; Voltage, Stand-off: 5.5V; Voltage, Vbr: 9V; Termination T... Check availability <https://pricing.snapeda.com/parts/PRTR5V0U2X/NXP%20Semiconductors/view-part?ref=eda>; AVAILABILITY: In Stock; DESCRIPTION: ESD Suppressor Diode Diode Array Uni-Dir 5.5V Automotive 4-Pin SOT-143B T/R; MF: NXP Semiconductors; MP: PRTR5V0U2X; PACKAGE: TO-253-4 NXP Semiconductors; PRICE: None; PURCHASE-URL: https://pricing.snapeda.com/search/part/PRTR5V0U2X/?ref=eda
J1 = MICRO-USB-10118192-0002LF:10118192-0002LF: USB - micro B USB 2.0 Receptacle Connector 5 Position Surface Mount, Right Angle Check availability <https://pricing.snapeda.com/parts/10118192-0002LF/Amphenol%20ICC%20%28FCI%29/view-part?ref=eda>; AVAILABILITY: In Stock; DESCRIPTION: Micro USB 2.0, Input Output Connectors, B TYPE RECEPTACLE without flange; MF: Amphenol ICC (FCI); MP: 10118192-0002LF; PACKAGE: None; PRICE: None; PURCHASE-URL: https://pricing.snapeda.com/search/part/10118192-0002LF/?ref=eda
LED1 LED2 = 150060VS75000:150060VS75000: LED,Wurth Elektronik,150060VS75000 Wurth Elektronik 150060VS75000, WL-SMCW Series Green LED, 570 nm, 1608 (0603) Clear, Rectangle Lens SMD Package Source: Datasheet <http://docs-emea.rs-online.com/webdocs/1302/0900766b81302e1e.pdf> Check prices <https://pricing.snapeda.com/parts/150060VS75000/Wurth%20Elektronik/view-part?ref=eda>; AVAILABILITY: In Stock; DESCRIPTION: Green 570nm LED Indication - Discrete 2V 0603 (1608 Metric); MF: Wurth Elektronik; MP: 150060VS75000; PACKAGE: None; PRICE: None
R1-R6 = rcl:R-US_: RESISTOR, American symbol; SPICEPREFIX: R
TP1-TP4 = testpad:TP: Test pad
U1 = FT232RL_SSOP28_:INTERFACE-FT232RL(SSOP28): 310070022 Check availability <https://pricing.snapeda.com/parts/FT232RL/FTDI%2C%20Future/view-part?ref=eda>; AVAILABILITY: In Stock; DESCRIPTION: USB Bridge, USB to UART USB 2.0 UART Interface 28-SSOP; MF: FTDI, Future; MP: FT232RL; PACKAGE: SSOP-28 FTDI, Future; PRICE: None; PURCHASE-URL: https://pricing.snapeda.com/search/part/FT232RL/?ref=eda